# EAGLE design overall schematic (EAGLE 7.7.0)

## Sheet 1 of 2
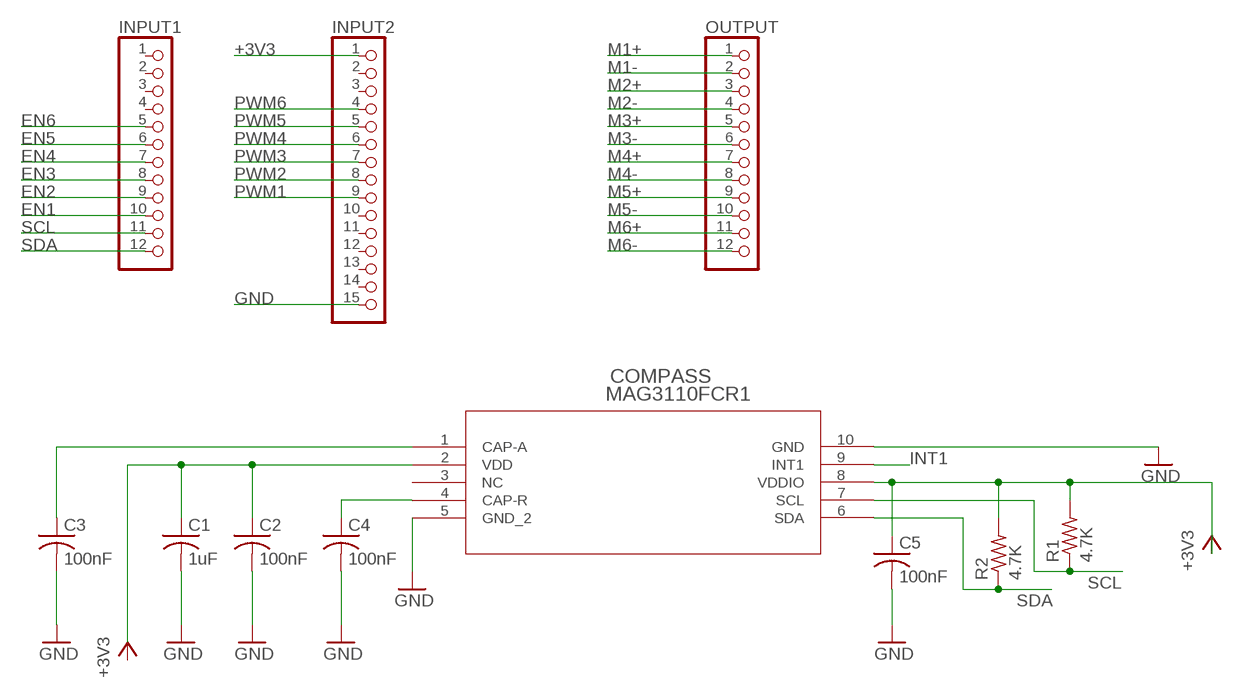
[diagram p0: schematic, sheet 1]

### Parts
C1  1uF  C-USC0603  [C0603]
C2  100nF  C-USC0603  [C0603]
C3  100nF  C-USC0603  [C0603]
C4  100nF  C-USC0603  [C0603]
C5  100nF  C-USC0603  [C0603]
COMPASS  MAG3110FCR1  [DFN10]
INPUT1  PINHD-1X12-CB  [1X12-CB]
INPUT2  PINHD-1X15-CB  [1X15-CB]
OUTPUT  PINHD-1X12-CB  [1X12-CB]
R1  4.7K  R-US_R0603  [R0603]
R2  4.7K  R-US_R0603  [R0603]

### Nets
+3V3: C5.1 COMPASS.8(VDDIO) INPUT2.1 R1.2 R2.2 ; also sheet 2
CAP-A: C3.1 COMPASS.1(CAP-A)
CAP-R: C4.1 COMPASS.4(CAP-R)
EN1: INPUT1.10 ; also sheet 2
EN2: INPUT1.9 ; also sheet 2
EN3: INPUT1.8 ; also sheet 2
EN4: INPUT1.7 ; also sheet 2
EN5: INPUT1.6 ; also sheet 2
EN6: INPUT1.5 ; also sheet 2
GND: C1.2 C2.2 C3.2 C4.2 C5.2 COMPASS.5(GND_2) COMPASS.10(GND) INPUT2.15 ; also sheet 2
INT1: COMPASS.9(INT1)
M1+: OUTPUT.1 ; also sheet 2
M1-: OUTPUT.2 ; also sheet 2
M2+: OUTPUT.3 ; also sheet 2
M2-: OUTPUT.4 ; also sheet 2
M3+: OUTPUT.5 ; also sheet 2
M3-: OUTPUT.6 ; also sheet 2
M4+: OUTPUT.7 ; also sheet 2
M4-: OUTPUT.8 ; also sheet 2
M5+: OUTPUT.9 ; also sheet 2
M5-: OUTPUT.10 ; also sheet 2
M6+: OUTPUT.11 ; also sheet 2
M6-: OUTPUT.12 ; also sheet 2
N$4: C1.1 C2.1 COMPASS.2(VDD)
PWM1: INPUT2.9 ; also sheet 2
PWM2: INPUT2.8 ; also sheet 2
PWM3: INPUT2.7 ; also sheet 2
PWM4: INPUT2.6 ; also sheet 2
PWM5: INPUT2.5 ; also sheet 2
PWM6: INPUT2.4 ; also sheet 2
SCL: COMPASS.7(SCL) INPUT1.11 R1.1
SDA: COMPASS.6(SDA) INPUT1.12 R2.1
Unconnected: COMPASS.3(NC) INPUT1.1 INPUT1.2 INPUT1.3 INPUT1.4 INPUT2.2 INPUT2.3 INPUT2.10 INPUT2.11 INPUT2.12 INPUT2.13 INPUT2.14

## Sheet 2 of 2
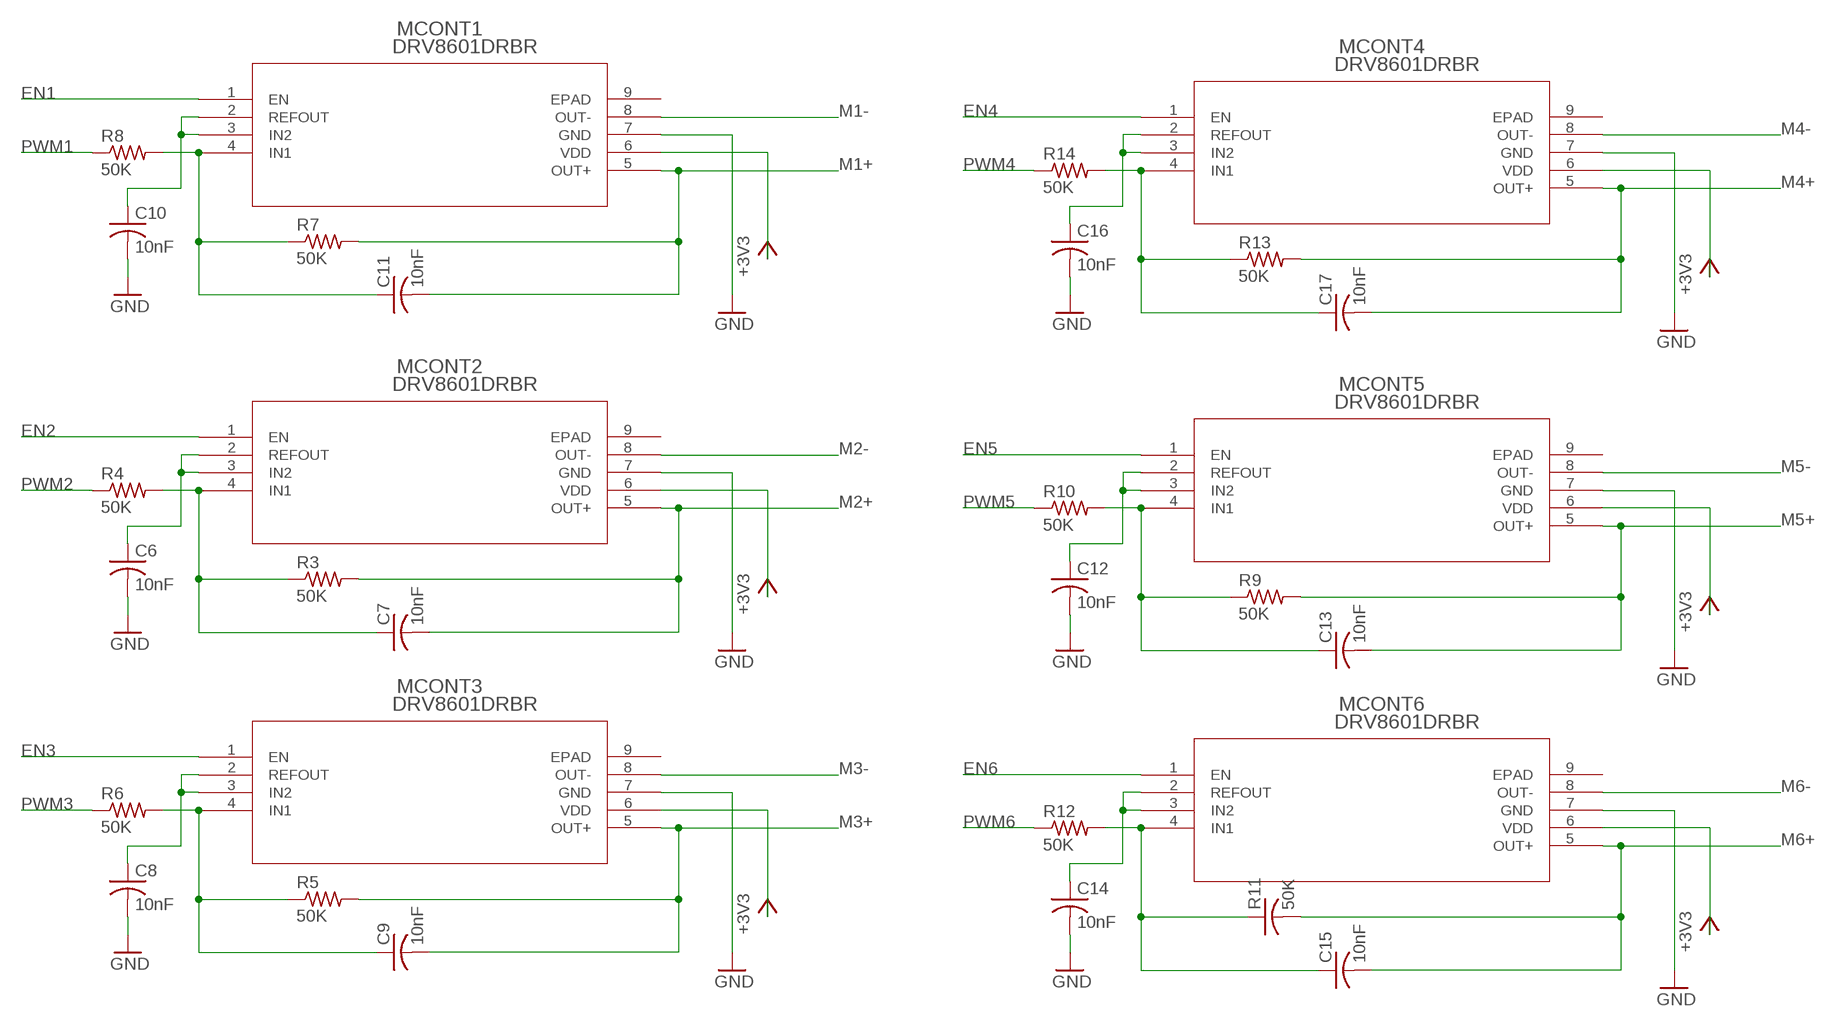
[diagram p1: schematic, sheet 2]

### Parts
C6  10nF  C-USC0603  [C0603]
C7  10nF  C-USC0603  [C0603]
C8  10nF  C-USC0603  [C0603]
C9  10nF  C-USC0603  [C0603]
C10  10nF  C-USC0603  [C0603]
C11  10nF  C-USC0603  [C0603]
C12  10nF  C-USC0603  [C0603]
C13  10nF  C-USC0603  [C0603]
C14  10nF  C-USC0603  [C0603]
C15  10nF  C-USC0603  [C0603]
C16  10nF  C-USC0603  [C0603]
C17  10nF  C-USC0603  [C0603]
MCONT1  DRV8601DRBR  [DRB8_1P75X1P5]
MCONT2  DRV8601DRBR  [DRB8_1P75X1P5]
MCONT3  DRV8601DRBR  [DRB8_1P75X1P5]
MCONT4  DRV8601DRBR  [DRB8_1P75X1P5]
MCONT5  DRV8601DRBR  [DRB8_1P75X1P5]
MCONT6  DRV8601DRBR  [DRB8_1P75X1P5]
R3  50K  R-US_R0603  [R0603]
R4  50K  R-US_R0603  [R0603]
R5  50K  R-US_R0603  [R0603]
R6  50K  R-US_R0603  [R0603]
R7  50K  R-US_R0603  [R0603]
R8  50K  R-US_R0603  [R0603]
R9  50K  R-US_R0603  [R0603]
R10  50K  R-US_R0603  [R0603]
R11  50K  C-USC0603  [C0603]
R12  50K  R-US_R0603  [R0603]
R13  50K  R-US_R0603  [R0603]
R14  50K  R-US_R0603  [R0603]

### Nets
+3V3: MCONT1.6(VDD) MCONT2.6(VDD) MCONT3.6(VDD) MCONT4.6(VDD) MCONT5.6(VDD) MCONT6.6(VDD) ; also sheet 1
EN1: MCONT1.1(EN) ; also sheet 1
EN2: MCONT2.1(EN) ; also sheet 1
EN3: MCONT3.1(EN) ; also sheet 1
EN4: MCONT4.1(EN) ; also sheet 1
EN5: MCONT5.1(EN) ; also sheet 1
EN6: MCONT6.1(EN) ; also sheet 1
FB1: C11.1 MCONT1.4(IN1) R7.1 R8.2
FB2: C7.1 MCONT2.4(IN1) R3.1 R4.2
FB3: C9.1 MCONT3.4(IN1) R5.1 R6.2
FB4: C17.1 MCONT4.4(IN1) R13.1 R14.2
FB5: C13.1 MCONT5.4(IN1) R9.1 R10.2
FB6: C15.1 MCONT6.4(IN1) R11.1 R12.2
FBA1: C10.1 MCONT1.2(REFOUT) MCONT1.3(IN2)
FBA2: C6.1 MCONT2.2(REFOUT) MCONT2.3(IN2)
FBA3: C8.1 MCONT3.2(REFOUT) MCONT3.3(IN2)
FBA4: C16.1 MCONT4.2(REFOUT) MCONT4.3(IN2)
FBA5: C12.1 MCONT5.2(REFOUT) MCONT5.3(IN2)
FBA6: C14.1 MCONT6.2(REFOUT) MCONT6.3(IN2)
GND: C6.2 C8.2 C10.2 C12.2 C14.2 C16.2 MCONT1.7(GND) MCONT2.7(GND) MCONT3.7(GND) MCONT4.7(GND) MCONT5.7(GND) MCONT6.7(GND) ; also sheet 1
M1+: C11.2 MCONT1.5(OUT+) R7.2 ; also sheet 1
M1-: MCONT1.8(OUT-) ; also sheet 1
M2+: C7.2 MCONT2.5(OUT+) R3.2 ; also sheet 1
M2-: MCONT2.8(OUT-) ; also sheet 1
M3+: C9.2 MCONT3.5(OUT+) R5.2 ; also sheet 1
M3-: MCONT3.8(OUT-) ; also sheet 1
M4+: C17.2 MCONT4.5(OUT+) R13.2 ; also sheet 1
M4-: MCONT4.8(OUT-) ; also sheet 1
M5+: C13.2 MCONT5.5(OUT+) R9.2 ; also sheet 1
M5-: MCONT5.8(OUT-) ; also sheet 1
M6+: C15.2 MCONT6.5(OUT+) R11.2 ; also sheet 1
M6-: MCONT6.8(OUT-) ; also sheet 1
PWM1: R8.1 ; also sheet 1
PWM2: R4.1 ; also sheet 1
PWM3: R6.1 ; also sheet 1
PWM4: R14.1 ; also sheet 1
PWM5: R10.1 ; also sheet 1
PWM6: R12.1 ; also sheet 1
Unconnected: MCONT1.9(EPAD) MCONT2.9(EPAD) MCONT3.9(EPAD) MCONT4.9(EPAD) MCONT5.9(EPAD) MCONT6.9(EPAD)

## Library data of the parts
C1-C17 R11 = resistor:C-US: CAPACITOR, American symbol
COMPASS = polaris_export_1:MAG3110FCR1; COPYRIGHT: Copyright C 2015 Accelerated Designs. All rights reserved; MANUFACTURER_PART_NUMBER: mag3110fcr1; VENDOR: Freescale
INPUT1 OUTPUT = adafruit:PINHD-1X12: PIN HEADER
INPUT2 = adafruit:PINHD-1X15: PIN HEADER
MCONT1-MCONT6 = polaris_export_1:DRV8601DRBR; 3D_LIBRARY_NAME: TI_AllParts_20121225; COPYRIGHT: Copyright C 2015 Accelerated Designs. All rights reserved; DATASHEETURL: httpwww.ti.comlitgpnDRV8601; FAMILY_NAME: MOTOR HAPTIC DRIVER; GENERIC_PART_NUMBER: DRV8601; INDUSTRY_STD_PKG_TYPE: SON; MANUFACTURER: Texas Instruments; MANUFACTURER_PART_NUMBER: DRV8601DRBR; PACKAGE_DESIGNATOR: DRB; PIN_COUNT: 8; VENDOR: Texas Instruments
R1-R10 R12-R14 = resistor:R-US_: RESISTOR, American symbol

## Board
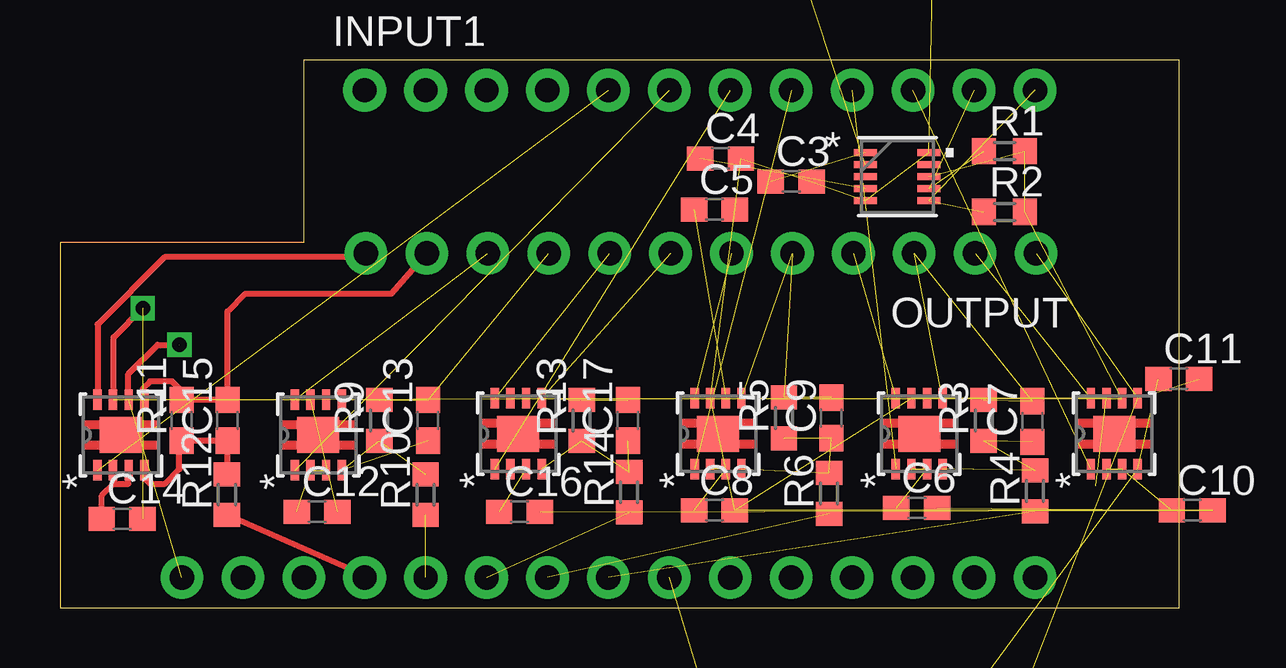
[diagram p2: board, top side]
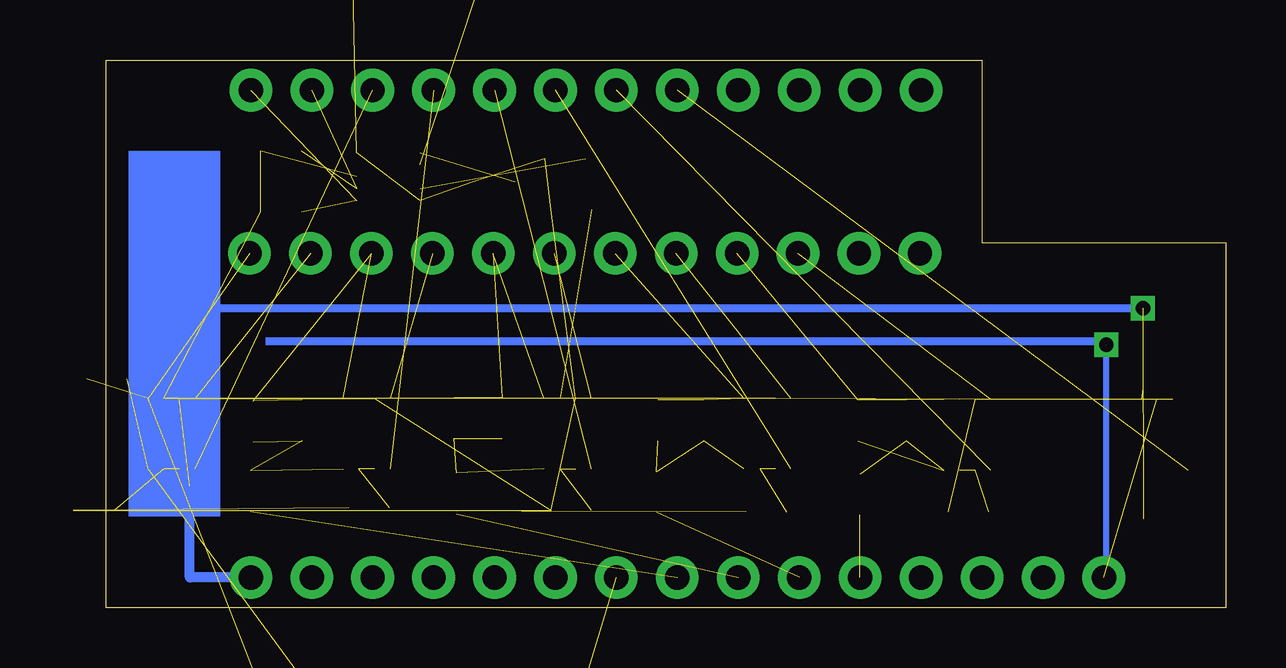
[diagram p3: board, bottom side, seen from below]

Size 46.66 x 22.85 mm. Coordinates in mm from the lower left corner, seen from the top.
Outline: 0,0 46.66,0 46.66,22.85 10.16,22.85 10.16,15.24 0,15.24 0,0
Copper layers (1*16): Top 0.035mm / dielectric 1.5mm / Bottom 0.035mm
Design rules "default *": minimum track width 6mil, minimum drill 13mil, track to track 6mil, track to pad 8mil, pad to pad 8mil, via to via 8mil, smd to smd 8mil, copper to edge 40mil, drill to drill 8mil, minimum pad ring 10mil, minimum via ring 8mil, stop-mask expansion 4mil, vias tented up to drill 0mil, thermal gap 10mil

### Footprints (pad centres in the part's own frame; a part is rotated, then mirrored left to right if it is on the bottom)
C0603 = smd 1.1 x 1: 1 -0.85,0; 2 0.85,0
DFN10 = smd 0.965 x 0.305: 1 -1.321,1; 2 -1.321,0.5; 3 -1.321,0; 4 -1.321,-0.5; 5 -1.321,-1; 6 1.321,-1; 7 1.321,-0.5; 8 1.321,0; 9 1.321,0.5; 10 1.321,1
1X12-CB = drill 1.016 pad 1.778: 1 -13.97,0; 2 -11.43,0; 3 -8.89,0; 4 -6.35,0; 5 -3.81,0; 6 -1.27,0; 7 1.27,0; 8 3.81,0; 9 6.35,0; 10 8.89,0; 11 11.43,0; 12 13.97,0
1X15-CB = drill 1.016 pad 1.778: 1 -17.78,0; 2 -15.24,0; 3 -12.7,0; 4 -10.16,0; 5 -7.62,0; 6 -5.08,0; 7 -2.54,0; 8 0,0; 9 2.54,0; 10 5.08,0; 11 7.62,0; 12 10.16,0; 13 12.7,0; 14 15.24,0; 15 17.78,0
DRB8_1P75X1P5 = smd 0.85 x 0.35: 1 -1.475,0.975; 2 -1.475,0.325; 3 -1.475,-0.325; 4 -1.475,-0.975; 5 1.475,-0.975; 6 1.475,-0.325; 7 1.475,0.325; 8 1.475,0.975 | smd 1.5 x 1.75: 9 0,0
R0603 = smd 1 x 1.1: 1 -0.85,0; 2 0.85,0

### Placement (x,y rotation side)
C1  30.48,30.48 0 top  (outside the outline)
C2  35.56,27.94 0 top  (outside the outline)
C3  30.48,17.78 0 top
C4  27.53,18.75 0 top
C5  27.28,16.61 0 top
C6  35.71,4.17 0 top
C7  40.54,7.77 90 top
C8  27.28,4.06 0 top
C9  32.16,7.92 90 top
C10  47.19,4.06 0 top
C11  46.63,9.55 0 top
C12  10.72,4.01 0 top
C13  15.34,7.82 90 top
C14  2.59,3.71 0 top
C15  6.98,7.82 90 top
C16  19.15,4.01 0 top
C17  23.67,7.82 90 top
COMPASS  34.9,17.98 0 top
INPUT1  26.67,21.59 0 top
INPUT2  22.86,1.27 0 top
MCONT1  43.94,7.26 90 top
MCONT2  35.81,7.26 90 top
MCONT3  27.43,7.26 90 top
MCONT4  19.1,7.26 90 top
MCONT5  10.77,7.21 90 top
MCONT6  2.54,7.21 90 top
OUTPUT  26.72,14.78 180 top
R1  39.37,19.05 0 top
R2  39.37,16.51 0 top
R3  38.51,7.82 90 top
R4  40.64,4.88 90 top
R5  30.18,7.92 90 top
R6  32.05,4.78 90 top
R7  34.29,-16.51 0 top  (outside the outline)
R8  30.48,-12.7 0 top  (outside the outline)
R9  13.31,7.82 90 top
R10  15.24,4.72 90 top
R11  5.08,7.82 90 top
R12  6.96,4.72 90 top
R13  21.74,7.82 90 top
R14  23.72,4.83 90 top

### Tracks (layer width: path | path; a pad name or v marks a point on that pad's centre or on a via)
+3V3  (10 unrouted)
  Top 0.254: MCONT6.6 2.85,8.71 2.85,9.75 4.06,10.97 4.98,10.97
  Bottom 0.254: INPUT2.1 4.98,1.37 4.98,10.97
CAP-A  (1 unrouted)
CAP-R  (1 unrouted)
EN1  (1 unrouted)
EN2  (1 unrouted)
EN3  (1 unrouted)
EN4  (1 unrouted)
EN5  (1 unrouted)
EN6  (1 unrouted)
FB1  (3 unrouted)
FB2  (3 unrouted)
FB3  (3 unrouted)
FB4  (3 unrouted)
FB5  (3 unrouted)
FB6
  Top 0.254: MCONT6.4 3.52,5.55 3.45,5.49 3.76,5.18 4.37,5.18 4.98,5.79 4.98,6.87 R11.1 C15.1 6.96,6.95 R12.2 6.98,5.37
FBA1  (2 unrouted)
FBA2  (2 unrouted)
FBA3  (2 unrouted)
FBA4  (2 unrouted)
FBA5  (2 unrouted)
FBA6
  Top 0.254: MCONT6.2 2.21,5.2 2.24,5.18 | 2.24,5.18 2.85,5.18 2.85,5.72 MCONT6.3 | C14.1 1.74,4.69 2.24,5.18
GND  (19 unrouted)
  Top 0.254: MCONT6.7 2.24,8.71 2.24,11.28 3.45,12.5
  Bottom 0.406: INPUT2.15 43.18,1.27 43.18,5.08
M1+  (3 unrouted)
M1-  (1 unrouted)
M2+  (3 unrouted)
M2-  (1 unrouted)
M3+  (3 unrouted)
M3-  (1 unrouted)
M4+  (3 unrouted)
M4-  (1 unrouted)
M5+  (3 unrouted)
M5-  (1 unrouted)
M6+  (1 unrouted)
  Top 0.254: 3.45,9.14 3.76,9.45 4.67,9.45 5.08,9.04 R11.2 C15.2 6.98,12.37 7.72,13.11 13.82,13.11 OUTPUT.11
M6-
  Top 0.254: OUTPUT.12 12.6,14.63 4.37,14.63 1.57,11.83 MCONT6.8
N$2  (via drill 0.6)
  other vias: 4.98,10.97
N$3  (via drill 0.6)
  other vias: 3.45,12.5
N$4  (2 unrouted)
PWM1  (1 unrouted)
PWM2  (1 unrouted)
PWM3  (1 unrouted)
PWM4  (1 unrouted)
PWM5  (1 unrouted)
PWM6
  Top 0.254: INPUT2.4 12.7,1.36 R12.1
SCL  (2 unrouted)
SDA  (2 unrouted)
(copper drawn outside any net)
  shapes: Bottom area x3